# EAGLE design VDS_botboard_beaglebone_revA (EAGLE 7.7.0)
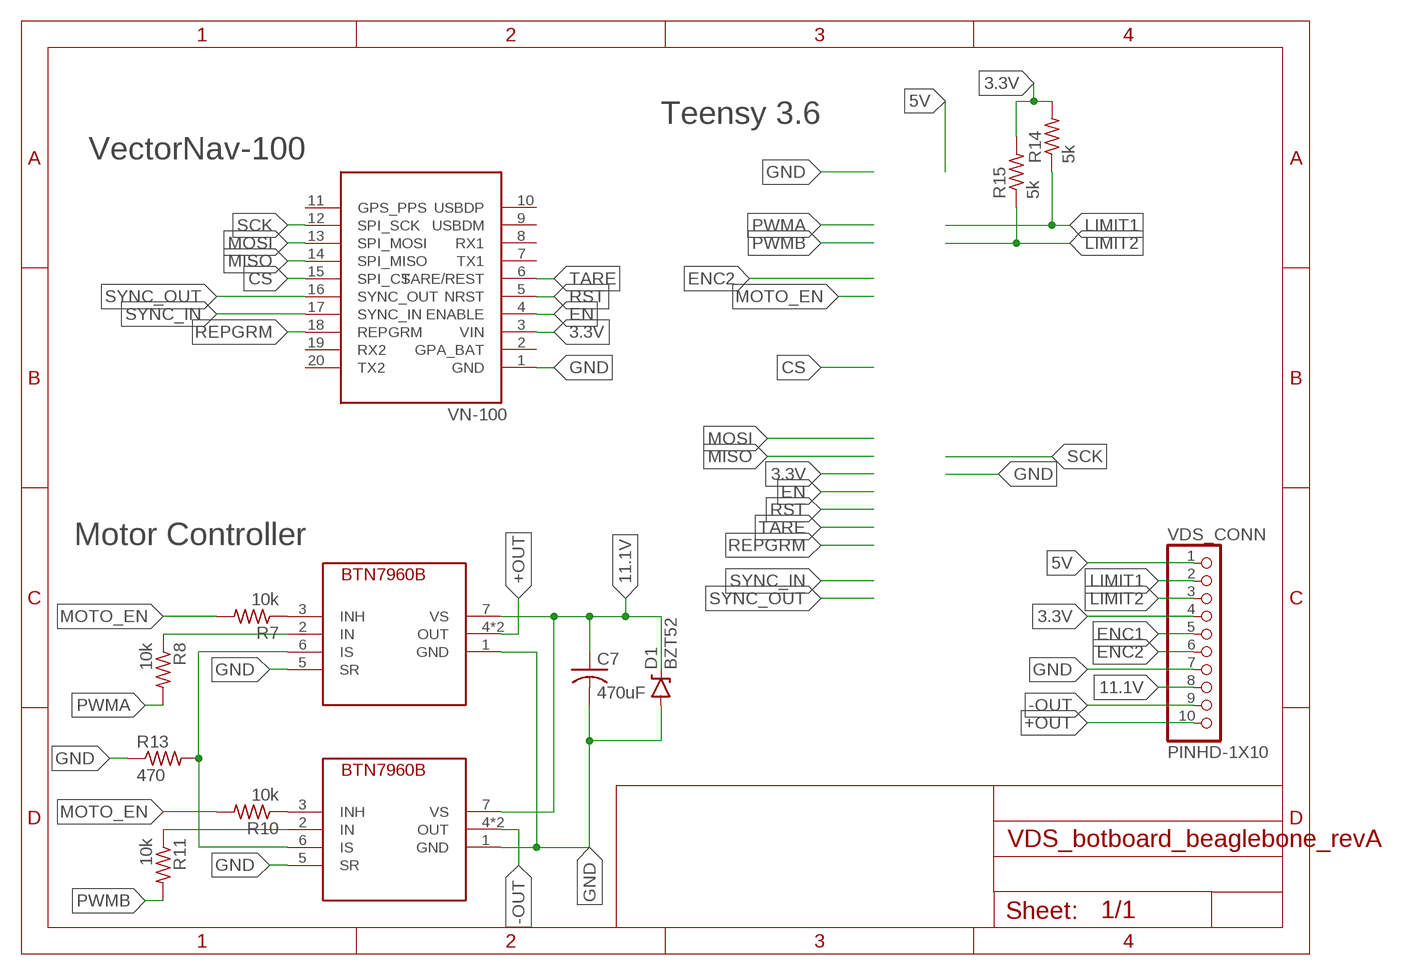
[diagram p0: schematic, sheet 1]

## Parts
C7  470uF  C-US050-024X044  [C050-024X044]
D1  BZT52  DIODE-ZENER  [DIODE-BZT52]
R7  10k  R-US_0204/5  [0204/5]
R8  10k  R-US_0204/5  [0204/5]
R10  10k  R-US_0204/5  [0204/5]
R11  10k  R-US_0204/5  [0204/5]
R13  470  R-US_0204/5  [0204/5]
R14  5k  R-US_0204/5  [0204/5]
R15  5k  R-US_0204/5  [0204/5]
U1  INF-PG-TO263-7-1_L_1_BTN7960B  [INF-PG-TO263-7-1_L_1PRIMARY]
U2  INF-PG-TO263-7-1_L_1_BTN7960B  [INF-PG-TO263-7-1_L_1PRIMARY]
VDS_CONN  PINHD-1X10  [1X10-BIG]
VN1  VECTORNAV-100  [VN-100]

## Nets
3.3V: R14.2 R15.2 VDS_CONN.4 VN1.3(VIN)
5V: VDS_CONN.1
11.1V: C7.1 D1.C U1.7(VS) U2.7(VS) VDS_CONN.8
+OUT: U1.4(OUT) U1.8(OUT) VDS_CONN.10
-OUT: U2.4(OUT) U2.8(OUT) VDS_CONN.9
CS: VN1.15(SPI_CS)
EN: VN1.4(ENABLE)
ENC1: VDS_CONN.5
ENC2: VDS_CONN.6
GND: C7.2 D1.A R13.1 U1.1(GND) U1.5(SR) U2.1(GND) U2.5(SR) VDS_CONN.7 VN1.1(GND)
IS: R13.2 U1.6(IS) U2.6(IS)
LIMIT1: R14.1 VDS_CONN.2
LIMIT2: R15.1 VDS_CONN.3
MISO: VN1.14(SPI_MISO)
MOSI: VN1.13(SPI_MOSI)
MOTO_EN: R7.2 R10.2
N$7: R7.1 U1.3(INH)
N$8: R8.1 U1.2(IN)
N$9: R10.1 U2.3(INH)
N$10: R11.1 U2.2(IN)
PWMA: R8.2
PWMB: R11.2
REPGRM: VN1.18(REPGRM)
RST: VN1.5(NRST)
SCK: VN1.12(SPI_SCK)
SYNC_IN: VN1.17(SYNC_IN)
SYNC_OUT: VN1.16(SYNC_OUT)
TARE: VN1.6(TARE/REST)
Unconnected: VN1.2(GPA_BAT) VN1.7(TX1) VN1.8(RX1) VN1.9(USBDM) VN1.10(USBDP) VN1.11(GPS_PPS) VN1.19(RX2) VN1.20(TX2)

## Notes on the sheet
- Teensy 3.6
- VectorNav-100
- Motor Controller

## Library data of the parts
C7 = adafruit:C-US: CAPACITOR, American symbol
D1 = SparkFun-DiscreteSemi:DIODE-ZENER: Zener Diode Production Part - 8199 3.4V Zener Voltage; PROD-ID: DIO-08199
R7 R8 R10 R11 R13-R15 = adafruit:R-US_: RESISTOR, American symbol
U1 U2 = INF-PG-TO263-7-1L:INF-PG-TO263-7-1_L_1
VDS_CONN = adafruit:PINHD-1X10: Pin header 1x10 0.1" spacing With round pins
VN1 = Vectornav-100_Breakout:VECTORNAV-100

## Net classes
0 default: width 1.016 mm, drill 0.508 mm, clearance 1.016 mm

## Board
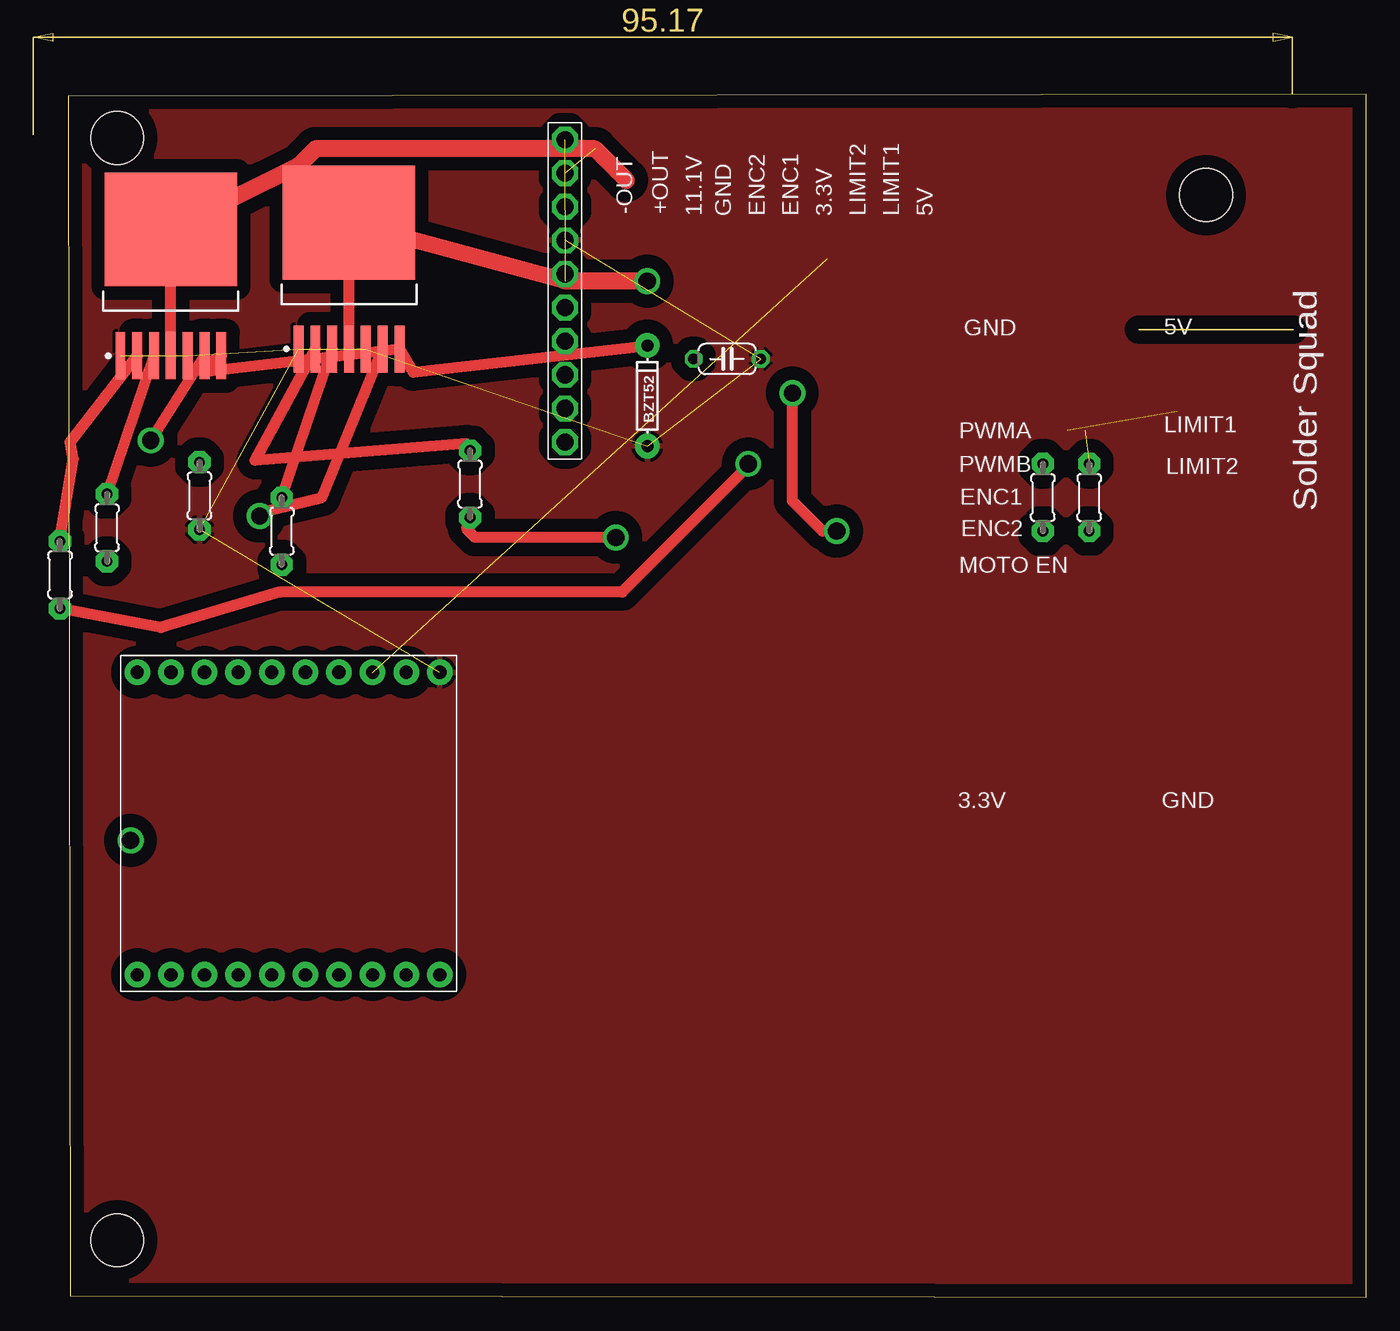
[diagram p1: board, top side]
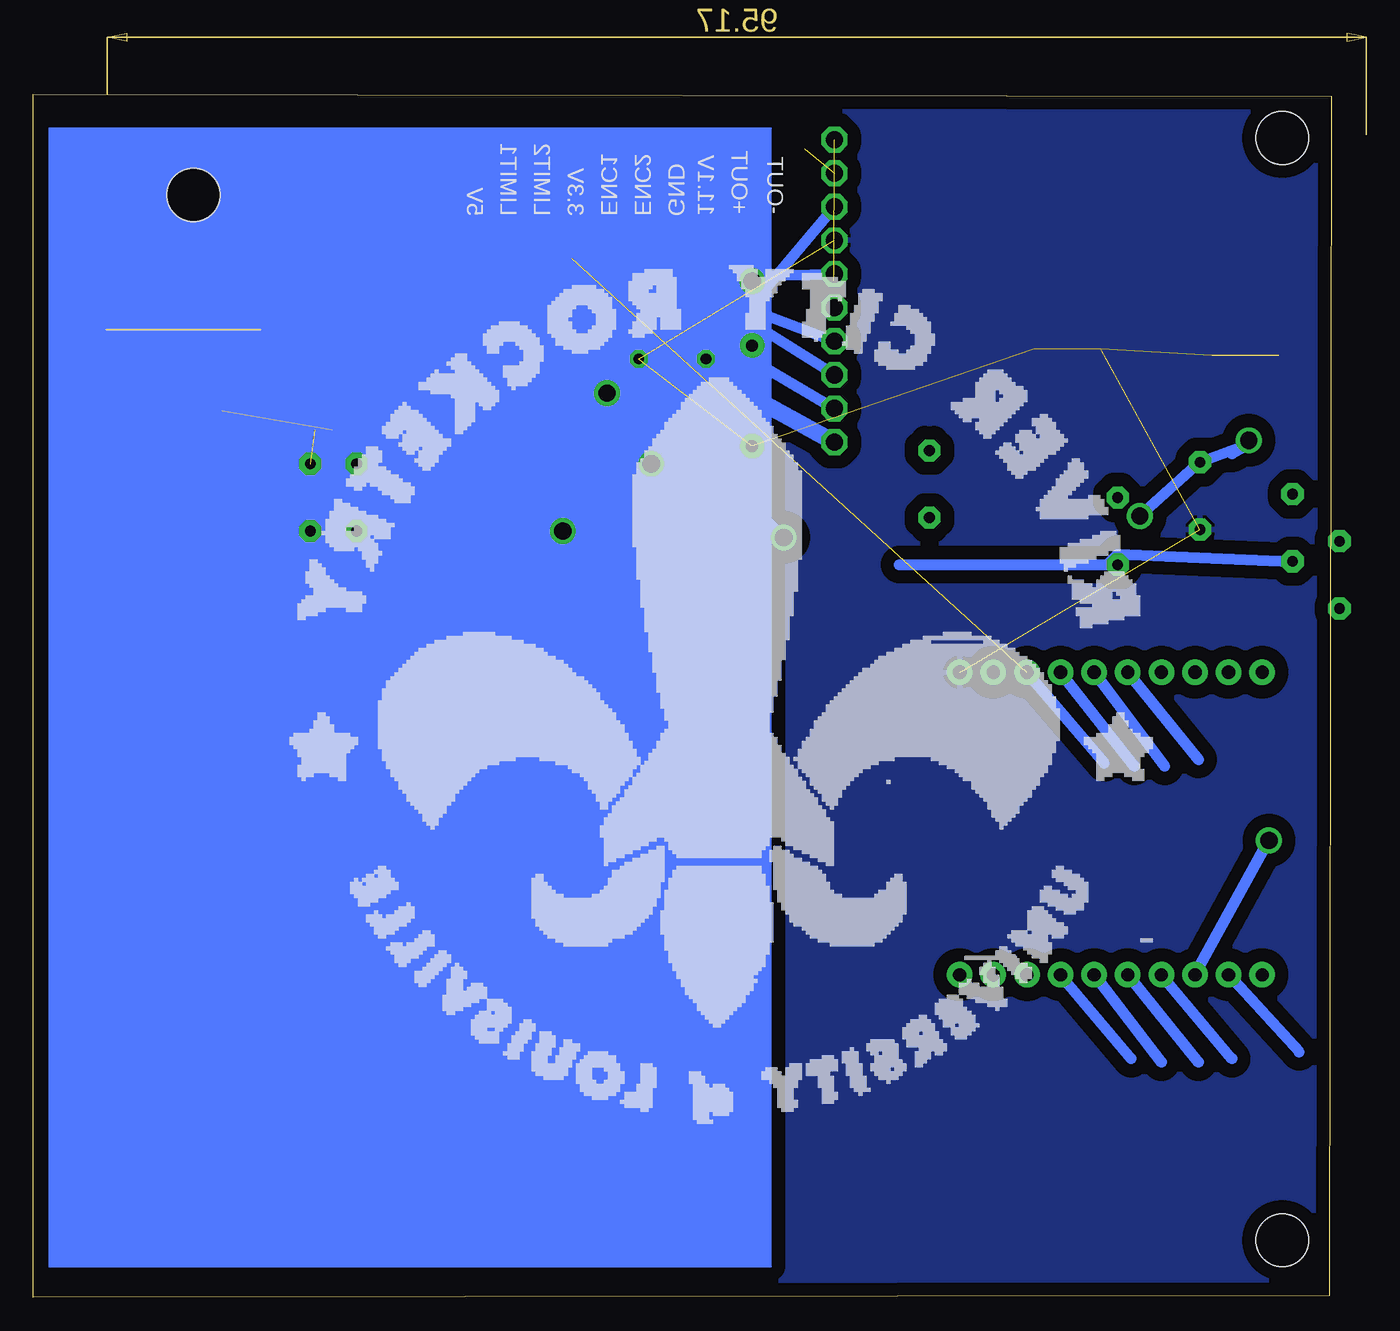
[diagram p2: board, bottom side, seen from below]

Size 98.09 x 90.92 mm. Coordinates in mm from the lower left corner, seen from the top.
Outline: 0.13,0.13 98.09,0 98.09,90.92 0,90.8 0.13,0.13
Copper layers (1*16): Top 0.035mm / dielectric 1.5mm / Bottom 0.035mm
Design rules "default *": minimum track width 10mil, minimum drill 20mil, track to track 10mil, track to pad 10mil, pad to pad 10mil, via to via 5mil, smd to smd 10mil, copper to edge 40mil, drill to drill 8mil, minimum pad ring 10mil, minimum via ring 8mil, stop-mask expansion 4mil, vias tented up to drill 0mil, thermal gap 10mil
Holes 4 mm at 3.68,87.63 85.98,83.31 1160.4,4.32 3.68,4.32

### Footprints (pad centres in the part's own frame; a part is rotated, then mirrored left to right if it is on the bottom)
C050-024X044 = drill 0.813 octagon: 1 -2.54,0; 2 2.54,0
DIODE-BZT52 = drill 0.9 pad 1.88: A -3.81,0; C 3.81,0
0204/5 = drill 0.813 pad 1.676 octagon: 1 -2.54,0; 2 2.54,0
INF-PG-TO263-7-1_L_1PRIMARY = smd 3.55 x 0.75: 1 -6.05,3.81; 2 -6.05,2.54; 3 -6.05,1.27; 4 -6.05,0; 5 -6.05,-1.27; 6 -6.05,-2.54; 7 -6.05,-3.81 | smd 8.6 x 10: 8 3.5,0
1X10-BIG = drill 1.3 pad 1.778 octagon: 1 -11.43,0; 2 -8.89,0; 3 -6.35,0; 4 -3.81,0; 5 -1.27,0; 6 1.27,0; 7 3.81,0; 8 6.35,0; 9 8.89,0; 10 11.43,0
VN-100 = drill 1 pad 1.93: 1 24.13,1.27; 2 24.13,3.81; 3 24.13,6.35; 4 24.13,8.89; 5 24.13,11.43; 6 24.13,13.97; 7 24.13,16.51; 8 24.13,19.05; 9 24.13,21.59; 10 24.13,24.13; 11 1.27,24.13; 12 1.27,21.59; 13 1.27,19.05; 14 1.27,16.51; 15 1.27,13.97; 16 1.27,11.43; 17 1.27,8.89; 18 1.27,6.35; 19 1.27,3.81; 20 1.27,1.27

### Placement (x,y rotation side)
C7  49.78,70.93 0 top
D1  43.75,68.14 90 top
R7  16.13,57.91 270 top
R8  30.35,61.47 270 top
R10  2.92,58.17 270 top
R11  -0.63,54.61 270 top
R13  9.91,60.58 90 top
R14  73.64,60.45 270 top
R15  77.15,60.45 270 top
U1  21.21,77.72 90 top
U2  7.75,77.22 90 top
VDS_CONN  37.53,76.07 90 top
VN1  29.34,23.11 90 top

### Tracks (layer width: path | path; a pad name or v marks a point on that pad's centre or on a via)
3.3V  (1 unrouted)
  Bottom 0.813: R15.2 R14.2 71.17,57.91 | 71.17,57.91 69.88,59.21 69.88,73.61 67.36,76.12 59.74,76.12 57.38,78.49 57.38,79.79 VDS_CONN.4 | 71.17,57.91 71.17,39.13 69.63,37.59 | VN1.3 17.15,40.39
5V
  Bottom 1.27: 75.89,73.15 69.27,79.78 65.06,79.78 VDS_CONN.1
11.1V
  Top 0.813: U2.7 9.02,69.79 9.53,70.04 10.54,69.98 U1.7 26.05,69.91 D1.C
  Bottom 0.813: D1.C C7.1 VDS_CONN.8
+OUT  (via drill 1.3)  (1 unrouted)
  Top 0.813: U1.4 U1.8
  Top 1.27: v43.75,76.8 37.57,76.8 U1.8
  Bottom 1.27: 44.7,77.76 v43.75,76.8
-OUT  (1 unrouted)
  Top 0.813: U2.4 U2.8
  Top 1.27: 42.16,84.42 39.78,86.8 18.67,86.8 17.4,85.54 U2.8
CS
  Bottom 0.813: VN1.15 10.03,17.78
EN
  Bottom 0.813: VN1.4 14.86,40.13
ENC2  (via drill 1.3)
  Top 0.813: v58.06,57.91 57,57.91 54.71,60.2 v54.71,68.35
  Bottom 0.813: v54.71,68.35 54.71,74.65 52.32,77.04 VDS_CONN.6
GND  (8 unrouted)
  pour Top: 0.13,90.68 0.13,0.25 98.17,-0.25 98.17,90.93
  pour Bottom: 0.13,90.68 -0.38,0.51 98.17,-0.25 98.17,90.93
IS  (via drill 1.3)
  Top 0.813: v14.45,59.05 14.48,59.31 19.18,60.45 U1.6 | v6.22,64.77 U2.6
  Bottom 0.813: v14.45,59.05 R13.2 5.84,64.64 7.49,63.75 6.22,64.52 v6.22,64.77
LIMIT1  (1 unrouted)
  Bottom 0.813: VDS_CONN.2 62.48,81.92 63.86,83.29 75.82,83.29 83.82,75.29 83.82,66.98 | R14.1 73.64,63.66 75.51,65.53
LIMIT2  (1 unrouted)
  Bottom 0.813: VDS_CONN.3 59.94,83.8 61.95,85.8 77.11,85.8 76.83,76.43 76.83,65.56
MISO
  Bottom 0.813: VN1.14 7.49,18.03
MOSI  (via drill 1.3 pad 1.95)
  Bottom 0.813: VN1.13 v4.7,34.54
MOTO_EN
  Bottom 0.813: 16.92,55.37 R7.2 | 32.64,55.37 16.92,55.37 | 16.92,55.37 16.13,56.17 R10.2
N$7
  Top 0.813: R7.1 U1.3
N$8
  Top 0.813: R8.1 30.1,64.52 14.1,63.25 U1.2
N$9
  Top 0.813: R10.1 U2.3
N$10
  Top 0.813: R11.1 0.38,63.37 0.13,64.64 U2.2
PWMA  (via drill 1.3)
  Top 0.813: v41.37,57.44 30.73,57.44 30.1,58.07 R8.2
  Bottom 0.813: 49.47,65.53 v41.37,57.44
PWMB  (via drill 1.3)
  Top 0.813: R11.2 6.99,50.61 15.97,53.31 41.85,53.31 51.37,62.83 v51.37,62.99
RST
  Bottom 0.813: VN1.5 12.57,40.13
SCK
  Bottom 0.813: VN1.12 2.41,18.54
SYNC_IN
  Bottom 0.813: VN1.17 15.11,18.03
SYNC_OUT
  Bottom 0.813: VN1.16 12.83,17.78
TARE
  Bottom 0.813: VN1.6 10.03,40.64
(copper drawn outside any net)
  shapes: Bottom area x1

### Text on the board
tPlace: -OUT | +OUT | 11.1V | GND | ENC2 | ENC1 | 3.3V | LIMIT2 | LIMIT1 | 5V | GND | 5V | PWMA | LIMIT1 | PWMB | LIMIT2 | ENC1 | Solder Squad | ENC2 | MOTO EN | 3.3V | GND
bPlace: -OUT | +OUT | 11.1V | GND | ENC2 | ENC1 | 3.3V | LIMIT2 | LIMIT1 | 5V